# Altium schematic sheet GL850G.SchDoc
size A4
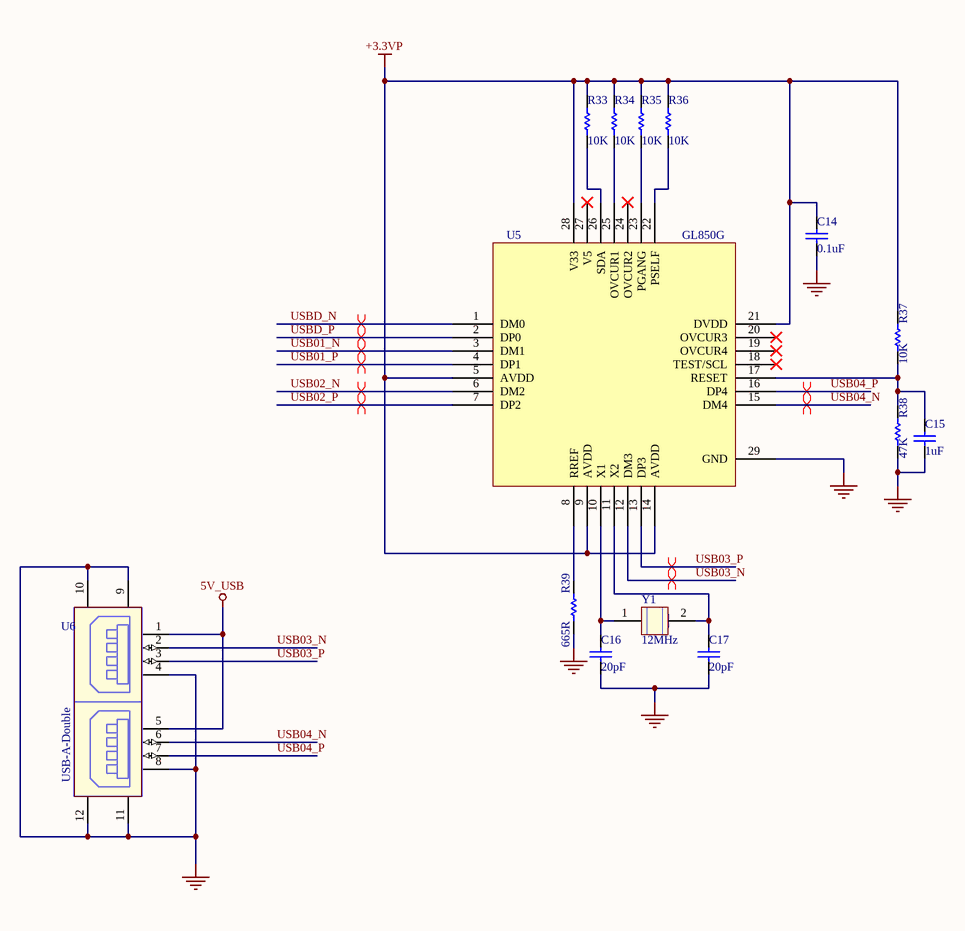
[diagram p0: GL850G.SchDoc]

## Parts
C14  value 0.1uF  [C0603L]  (hidden comment: Cap Semi)
C15  value 1uF  [C0603L]  (hidden comment: Cap Semi)
C16  value 20pF  [C0603L]  (hidden comment: Cap Semi)
C17  value 20pF  [C0603L]  (hidden comment: Cap Semi)
R33  value 10K  [R0603L]  (hidden comment: Res Semi)
R34  value 10K  [R0603L]  (hidden comment: Res Semi)
R35  value 10K  [R0603L]  (hidden comment: Res Semi)
R36  value 10K  [R0603L]  (hidden comment: Res Semi)
R37  value 10K  [R0603L]  (hidden comment: Res Semi)
R38  value 47K  [R0603L]  (hidden comment: Res Semi)
R39  value 665R  [R0603L]  (hidden comment: Res Semi)
U5  GL850G  [GL850G-QFN28]
U6  USB-A-Double  [USB-DB]
Y1  value 12MHz  [XTAL1]  (hidden comment: Oscillator)

## Nets
5V_USB: U6.1(V+) U6.5(NC)
+3.3VP: C14.1 R33.2 R34.2 R35.2 R36.2 R37.2 U5.5(AVDD) U5.9(AVDD) U5.14(AVDD) U5.21(DVDD) U5.28(V33)
GND: C14.2 C15.2 C16.2 C17.2 R38.1 R39.1 U5.29(GND) U6.4(G) U6.8(NC) U6.9 U6.10 U6.11 U6.12
USB01_N: U5.3(DM1)
USB01_P: U5.4(DP1)
USB02_N: U5.6(DM2)
USB02_P: U5.7(DP2)
USB03_N: U5.12(DM3) U6.2(D-)
USB03_P: U5.13(DP3) U6.3(D+)
USB04_N: U5.15(DM4) U6.6(NC)
USB04_P: U5.16(DP4) U6.7(NC)
USBD_N: U5.1(DM0)
USBD_P: U5.2(DP0)
NetC15_1: C15.1 R37.1 R38.2 U5.17(RESET)
NetC16_1: C16.1 U5.10(X1) Y1.1
NetC17_1: C17.1 U5.11(X2) Y1.2
NetR33_1: R33.1 U5.26(SDA)
NetR34_1: R34.1 U5.25(OVCUR1)
NetR35_1: R35.1 U5.23(PGANG)
NetR36_1: R36.1 U5.22(PSELF)
NetR39_2: R39.2 U5.8(RREF)

Not connected (* = marked no-connect by the designer): U5 18(TEST/SCL)* 19(OVCUR4)* 20(OVCUR3)* 24(OVCUR2)* 27(V5)*

## Layout directives
differential pair: USB01_N, USB01_P, USB02_N, USB02_P, USB03_N, USB03_P, USB04_N, USB04_P, USBD_N, USBD_P

## Library data of the parts
C14-C17 = Cap Semi: Capacitor (Semiconductor SIM Model); Published: 8-Jun-2000; LatestRevisionDate: 17-Jul-2002; LatestRevisionNote: Re-released for DXP Platform.; PackageReference: C1206; Publisher: Altium Limited
R33-R39 = Res Semi: Semiconductor Resistor; Published: 8-Jun-2000; LatestRevisionDate: 17-Jul-2002; LatestRevisionNote: Re-released for DXP Platform.; PackageReference: AXIAL-0.5; Publisher: Altium Limited